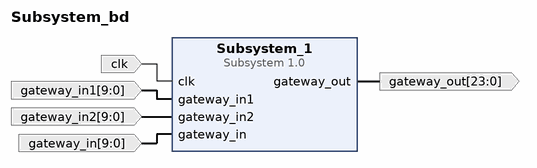
[diagram p0: block diagram of the top level]
# Vivado block design Subsystem_bd, xc7s50csga324-1, Vivado 2023.2
create_bd_design Subsystem_bd

create_bd_port -dir I -type clk clk
create_bd_port -dir I -from 9 -to 0 -type data gateway_in
create_bd_port -dir I -from 9 -to 0 -type data gateway_in1
create_bd_port -dir I -from 9 -to 0 -type data gateway_in2
create_bd_port -dir O -from 23 -to 0 -type data gateway_out

create_bd_cell -type ip -vlnv User_Company:VMC:Subsystem:1.0 Subsystem_1

# ---- connections ----

connect_bd_net [get_bd_pins Subsystem_1/gateway_out] [get_bd_ports gateway_out]
connect_bd_net [get_bd_ports clk] [get_bd_pins Subsystem_1/clk]
connect_bd_net -net gateway_in1_1 [get_bd_ports gateway_in1] [get_bd_pins Subsystem_1/gateway_in1]
connect_bd_net -net gateway_in2_1 [get_bd_ports gateway_in2] [get_bd_pins Subsystem_1/gateway_in2]
connect_bd_net [get_bd_ports gateway_in] [get_bd_pins Subsystem_1/gateway_in]

validate_bd_design
save_bd_design
